# Altium schematic sheet 2_TB6612（3）.schdoc.schdoc
size 309 x 223 mm; Symbol: Sheet-Symbol_A4; Device: Sheet-Symbol_A4; Company: 嘉立创EDA; Drawed: 吴登珂; Version: V1.0; Page Size: A4; @Project Name: TB6612; @Page Count: 4; @Update Date: 2024-04-14; @Create Date: 2024-04-14; @Schematic Name: Schematic1; @Page No: 3; @Page Name: TB6612（3）
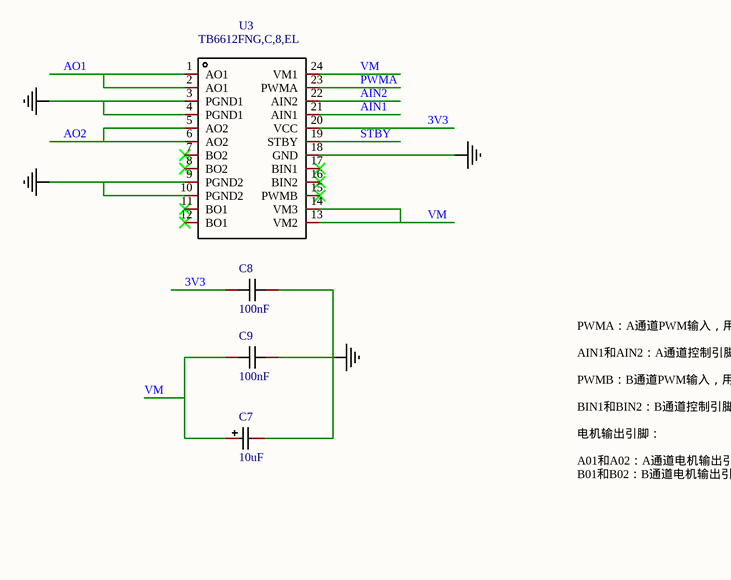
[diagram p0: 2_TB6612（3）.schdoc.schdoc]

## Parts
C7  10uF  [CAP-SMD_L3.5-W2.8-R-RD]
C8  100nF  [C0603]
C9  100nF  [C0603]
U3  TB6612FNG,C,8,EL  [SSOP-24_L8.3-W5.6-P0.65-LS7.6-BL]

## Nets
NetC7_2: C7.2 C8.2 C9.2 U3.3(PGND1) U3.4(PGND1) U3.9(PGND2) U3.10(PGND2) U3.18(GND)
3V3: C8.1 U3.20(VCC)
AIN1: U3.21(AIN1)
AIN2: U3.22(AIN2)
AO1: U3.1(AO1) U3.2(AO1)
AO2: U3.5(AO2) U3.6(AO2)
PWMA: U3.23(PWMA)
STBY: U3.19(STBY)
VM: C7.1 C9.1 U3.13(VM2) U3.14(VM3) U3.24(VM1)

Not connected (* = marked no-connect by the designer): U3 7(BO2)* 8(BO2)* 11(BO1)* 12(BO1)* 15(PWMB)* 16(BIN2)* 17(BIN1)*

## Notes on the sheet
- PWMA：A通道PWM输入，用于控制A通道电机的速度。
  AIN1和AIN2：A通道控制引脚，用于控制A通道电机的方向。
  PWMB：B通道PWM输入，用于控制B通道电机的速度。
  BIN1和BIN2：B通道控制引脚，用于控制B通道电机的方向。
- 电机输出引脚：
  A01和A02：A通道电机输出引脚。
  B01和B02：B通道电机输出引脚。
- 1
- 2
- 3
- 4
- 5
- 6
- A
- B
- C
- 原理图
- Schematic1
- 创建日期
- 更新日期
- 2024-04-14
- 审阅
- 绘制
- 图页
- 吴登珂
- TB6612（3）
- 物料编码
- TB6612
- D
- 版本
- 尺寸
- 页
- 共
- V1.0
- A4
- 嘉立创EDA

## Library data of the parts
C7 = TAJB106K025RNJ: Manufacturer: Kyocera AVX; Add into BOM: yes; Tolerance: ±10%; Rated Voltage: 25V; Equivalent Series Resistance(ESR): 2.5Ω@100kHz; Description: 容值:10uF;精度:±10%;额定电压:25V;等效串联电阻:2.5Ω@100kHz;; Name: 10uF; Symbol: TAJB106K025RNJ; Device: TAJB106K025RNJ; LCSC Part Name: 10uF ±10% 25V; Supplier Part: C7194; Manufacturer Part: TAJB106K025RNJ; Supplier Footprint: CASE-B-3528; JLCPCB Part Class: 扩展库; Datasheet: https://atta.szlcsc.com/upload/public/pdf/source/20160107/1457707750344.pdf; Supplier: LCSC; Convert to PCB: yes; Value: 10uF; Operating Temperature: -55℃~+125℃
C8 C9 = CAP_0603: Symbol: CapAcitance; Convert to PCB: yes; Name: 100nF; Device: CAP_0603; Add into BOM: yes; Supplier Footprint: 0603; Value: 100nF
U3 = TB6612FNG,C,8,EL: Manufacturer: TOSHIBA(东芝); Add into BOM: yes; Drive motor type: 有刷直流电机; Supply Voltage: 2.7V~5.5V; Output Current: 1A; Interface: 并行; Description: 驱动电机类型:有刷直流电机;电源电压:2.7V~5.5V;输出电流:1A;接口:并行;; Name: TB6612FNG,C,8,EL; Symbol: TB6612FNG,C,8,EL; Device: TB6612FNG,C,8,EL; LCSC Part Name: 1A 有刷直流电机驱动芯片 5.5V; Supplier Part: C141517; Manufacturer Part: TB6612FNG,C,8,EL; Supplier Footprint: SSOP-24; JLCPCB Part Class: 扩展库; Datasheet: https://atta.szlcsc.com/upload/public/pdf/source/20171128/C141517_15118625624231147036.pdf; Supplier: LCSC; Convert to PCB: yes; Operating Temperature: -20℃~+85℃@(Ta)